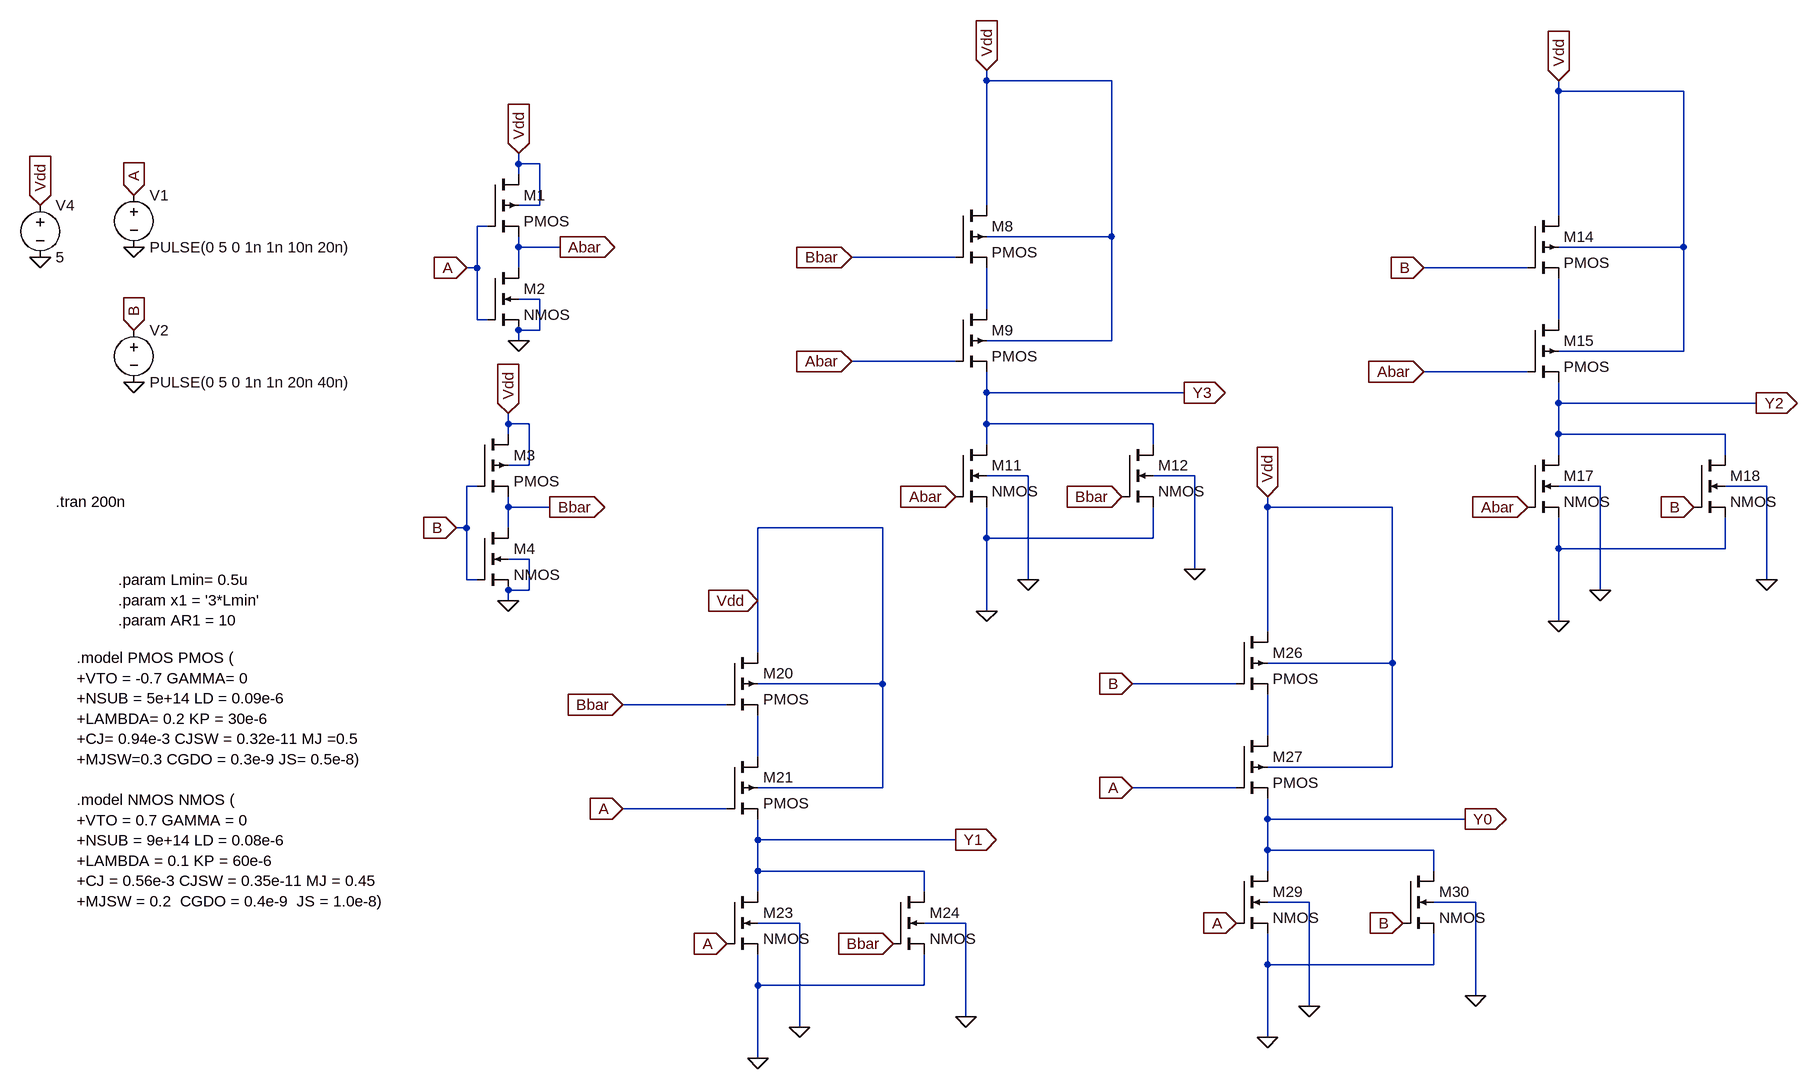
[diagram p0: schematic CMOS 2x4 decoder.asc]
CMOS 2x4 decoder.asc, the LTspice schematic file:
Version 4
SHEET 1 2264 3572
WIRE 976 -112 976 -128
WIRE 1168 -112 976 -112
WIRE 1856 -96 1856 -112
WIRE 2048 -96 1856 -96
WIRE 256 16 256 0
WIRE 288 16 256 16
WIRE 256 32 256 16
WIRE 288 80 288 16
WIRE 288 80 256 80
WIRE 976 80 976 -112
WIRE 1856 96 1856 -96
WIRE 208 112 192 112
WIRE 1168 128 1168 -112
WIRE 1168 128 976 128
WIRE 256 144 256 128
WIRE 320 144 256 144
WIRE 2048 144 2048 -96
WIRE 2048 144 1856 144
WIRE 928 160 768 160
WIRE 192 176 192 112
WIRE 192 176 176 176
WIRE 256 176 256 144
WIRE 1808 176 1648 176
WIRE 288 224 256 224
WIRE 976 240 976 176
WIRE 192 256 192 176
WIRE 208 256 192 256
WIRE 1856 256 1856 192
WIRE 288 272 288 224
WIRE 288 272 256 272
WIRE 256 288 256 272
WIRE 1168 288 1168 128
WIRE 1168 288 976 288
WIRE 2048 304 2048 144
WIRE 2048 304 1856 304
WIRE 928 320 768 320
WIRE 1808 336 1648 336
WIRE 976 368 976 336
WIRE 1280 368 976 368
WIRE 1856 384 1856 352
WIRE 2160 384 1856 384
WIRE 240 416 240 400
WIRE 272 416 240 416
WIRE 976 416 976 368
WIRE 1232 416 976 416
WIRE 240 432 240 416
WIRE 1856 432 1856 384
WIRE 2112 432 1856 432
WIRE 976 448 976 416
WIRE 1232 448 1232 416
WIRE 1856 464 1856 432
WIRE 2112 464 2112 432
WIRE 272 480 272 416
WIRE 272 480 240 480
WIRE 1040 496 976 496
WIRE 1296 496 1232 496
WIRE 192 512 176 512
WIRE 1920 512 1856 512
WIRE 2176 512 2112 512
WIRE 240 544 240 528
WIRE 304 544 240 544
WIRE 1408 544 1408 528
WIRE 1600 544 1408 544
WIRE 176 576 176 512
WIRE 176 576 160 576
WIRE 240 576 240 544
WIRE 816 576 624 576
WIRE 976 592 976 544
WIRE 1232 592 1232 544
WIRE 1232 592 976 592
WIRE 1856 608 1856 560
WIRE 2112 608 2112 560
WIRE 2112 608 1856 608
WIRE 272 624 240 624
WIRE 1296 640 1296 496
WIRE 176 656 176 576
WIRE 192 656 176 656
WIRE 1040 656 1040 496
WIRE 2176 656 2176 512
WIRE 272 672 272 624
WIRE 272 672 240 672
WIRE 1920 672 1920 512
WIRE 240 688 240 672
WIRE 624 688 624 576
WIRE 976 704 976 592
WIRE 1856 720 1856 608
WIRE 1408 736 1408 544
WIRE 624 768 624 688
WIRE 1600 784 1600 544
WIRE 1600 784 1408 784
WIRE 816 816 816 576
WIRE 816 816 624 816
WIRE 1360 816 1200 816
WIRE 576 848 416 848
WIRE 1408 896 1408 832
WIRE 624 928 624 864
WIRE 1600 944 1600 784
WIRE 1600 944 1408 944
WIRE 816 976 816 816
WIRE 816 976 624 976
WIRE 1360 976 1200 976
WIRE 576 1008 416 1008
WIRE 1408 1024 1408 992
WIRE 1712 1024 1408 1024
WIRE 624 1056 624 1024
WIRE 928 1056 624 1056
WIRE 1408 1072 1408 1024
WIRE 1664 1072 1408 1072
WIRE 624 1104 624 1056
WIRE 880 1104 624 1104
WIRE 1408 1104 1408 1072
WIRE 1664 1104 1664 1072
WIRE 624 1136 624 1104
WIRE 880 1136 880 1104
WIRE 1472 1152 1408 1152
WIRE 1728 1152 1664 1152
WIRE 688 1184 624 1184
WIRE 944 1184 880 1184
WIRE 1408 1248 1408 1200
WIRE 1664 1248 1664 1200
WIRE 1664 1248 1408 1248
WIRE 624 1280 624 1232
WIRE 880 1280 880 1232
WIRE 880 1280 624 1280
WIRE 1728 1296 1728 1152
WIRE 1472 1312 1472 1152
WIRE 944 1328 944 1184
WIRE 688 1344 688 1184
WIRE 1408 1360 1408 1248
WIRE 624 1392 624 1280
FLAG 256 288 0
FLAG 176 176 A
IOPIN 176 176 In
FLAG 320 144 Abar
IOPIN 320 144 Out
FLAG 256 0 Vdd
IOPIN 256 0 In
FLAG -336 272 B
IOPIN -336 272 In
FLAG -336 64 A
IOPIN -336 64 In
FLAG -336 144 0
FLAG -336 352 0
FLAG 240 688 0
FLAG 160 576 B
IOPIN 160 576 In
FLAG 304 544 Bbar
IOPIN 304 544 Out
FLAG 240 400 Vdd
IOPIN 240 400 In
FLAG 976 -128 Vdd
IOPIN 976 -128 In
FLAG 928 528 Abar
IOPIN 928 528 In
FLAG 1184 528 Bbar
IOPIN 1184 528 In
FLAG 1280 368 Y3
IOPIN 1280 368 Out
FLAG -480 80 Vdd
IOPIN -480 80 In
FLAG -480 160 0
FLAG 976 704 0
FLAG 1040 656 0
FLAG 1296 640 0
FLAG 768 160 Bbar
IOPIN 768 160 In
FLAG 768 320 Abar
IOPIN 768 320 In
FLAG 1856 -112 Vdd
IOPIN 1856 -112 In
FLAG 1808 544 Abar
IOPIN 1808 544 In
FLAG 2064 544 B
IOPIN 2064 544 In
FLAG 2160 384 Y2
IOPIN 2160 384 Out
FLAG 1856 720 0
FLAG 1920 672 0
FLAG 2176 656 0
FLAG 1648 176 B
IOPIN 1648 176 In
FLAG 1648 336 Abar
IOPIN 1648 336 In
FLAG 624 688 Vdd
IOPIN 624 688 In
FLAG 576 1216 A
IOPIN 576 1216 In
FLAG 832 1216 Bbar
IOPIN 832 1216 In
FLAG 928 1056 Y1
IOPIN 928 1056 Out
FLAG 624 1392 0
FLAG 688 1344 0
FLAG 944 1328 0
FLAG 416 848 Bbar
IOPIN 416 848 In
FLAG 416 1008 A
IOPIN 416 1008 In
FLAG 1408 528 Vdd
IOPIN 1408 528 In
FLAG 1360 1184 A
IOPIN 1360 1184 In
FLAG 1616 1184 B
IOPIN 1616 1184 In
FLAG 1712 1024 Y0
IOPIN 1712 1024 Out
FLAG 1408 1360 0
FLAG 1472 1312 0
FLAG 1728 1296 0
FLAG 1200 816 B
IOPIN 1200 816 In
FLAG 1200 976 A
IOPIN 1200 976 In
SYMBOL pmos4 208 32 R0
SYMATTR InstName M1
SYMATTR Value2 l={Lmin} w={AR1*Lmin} ad={x1*AR1*Lmin} as={x1*AR1*Lmin} pd={2*x1 + 2*AR1*Lmin} ps={2*x1 + 2*AR1*Lmin}
SYMBOL nmos4 208 176 R0
SYMATTR InstName M2
SYMATTR Value2 l={Lmin} w={AR1*Lmin} ad={x1*AR1*Lmin} as={x1*AR1*Lmin} pd={2*x1 + 2*AR1*Lmin} ps={2*x1 + 2*AR1*Lmin}
SYMBOL voltage -336 48 R0
WINDOW 123 0 0 Left 0
WINDOW 39 0 0 Left 0
SYMATTR InstName V1
SYMATTR Value PULSE(0 5 0 1n 1n 10n 20n)
SYMBOL voltage -336 256 R0
WINDOW 123 0 0 Left 0
WINDOW 39 0 0 Left 0
SYMATTR InstName V2
SYMATTR Value PULSE(0 5 0 1n 1n 20n 40n)
SYMBOL pmos4 192 432 R0
SYMATTR InstName M3
SYMATTR Value2 l={Lmin} w={AR1*Lmin} ad={x1*AR1*Lmin} as={x1*AR1*Lmin} pd={2*x1 + 2*AR1*Lmin} ps={2*x1 + 2*AR1*Lmin}
SYMBOL nmos4 192 576 R0
SYMATTR InstName M4
SYMATTR Value2 l={Lmin} w={AR1*Lmin} ad={x1*AR1*Lmin} as={x1*AR1*Lmin} pd={2*x1 + 2*AR1*Lmin} ps={2*x1 + 2*AR1*Lmin}
SYMBOL pmos4 928 80 R0
SYMATTR InstName M8
SYMATTR Value2 l={Lmin} w={AR1*Lmin} ad={x1*AR1*Lmin} as={x1*AR1*Lmin} pd={2*x1 + 2*AR1*Lmin} ps={2*x1 + 2*AR1*Lmin}
SYMBOL pmos4 928 240 R0
SYMATTR InstName M9
SYMATTR Value2 l={Lmin} w={AR1*Lmin} ad={x1*AR1*Lmin} as={x1*AR1*Lmin} pd={2*x1 + 2*AR1*Lmin} ps={2*x1 + 2*AR1*Lmin}
SYMBOL nmos4 928 448 R0
SYMATTR InstName M11
SYMATTR Value2 l={Lmin} w={AR1*Lmin} ad={x1*AR1*Lmin} as={x1*AR1*Lmin} pd={2*x1 + 2*AR1*Lmin} ps={2*x1 + 2*AR1*Lmin}
SYMBOL nmos4 1184 448 R0
SYMATTR InstName M12
SYMATTR Value2 l={Lmin} w={AR1*Lmin} ad={x1*AR1*Lmin} as={x1*AR1*Lmin} pd={2*x1 + 2*AR1*Lmin} ps={2*x1 + 2*AR1*Lmin}
SYMBOL voltage -480 64 R0
WINDOW 123 0 0 Left 0
WINDOW 39 0 0 Left 0
SYMATTR InstName V4
SYMATTR Value 5
SYMBOL pmos4 1808 96 R0
SYMATTR InstName M14
SYMATTR Value2 l={Lmin} w={AR1*Lmin} ad={x1*AR1*Lmin} as={x1*AR1*Lmin} pd={2*x1 + 2*AR1*Lmin} ps={2*x1 + 2*AR1*Lmin}
SYMBOL pmos4 1808 256 R0
SYMATTR InstName M15
SYMATTR Value2 l={Lmin} w={AR1*Lmin} ad={x1*AR1*Lmin} as={x1*AR1*Lmin} pd={2*x1 + 2*AR1*Lmin} ps={2*x1 + 2*AR1*Lmin}
SYMBOL nmos4 1808 464 R0
SYMATTR InstName M17
SYMATTR Value2 l={Lmin} w={AR1*Lmin} ad={x1*AR1*Lmin} as={x1*AR1*Lmin} pd={2*x1 + 2*AR1*Lmin} ps={2*x1 + 2*AR1*Lmin}
SYMBOL nmos4 2064 464 R0
SYMATTR InstName M18
SYMATTR Value2 l={Lmin} w={AR1*Lmin} ad={x1*AR1*Lmin} as={x1*AR1*Lmin} pd={2*x1 + 2*AR1*Lmin} ps={2*x1 + 2*AR1*Lmin}
SYMBOL pmos4 576 768 R0
SYMATTR InstName M20
SYMATTR Value2 l={Lmin} w={AR1*Lmin} ad={x1*AR1*Lmin} as={x1*AR1*Lmin} pd={2*x1 + 2*AR1*Lmin} ps={2*x1 + 2*AR1*Lmin}
SYMBOL pmos4 576 928 R0
SYMATTR InstName M21
SYMATTR Value2 l={Lmin} w={AR1*Lmin} ad={x1*AR1*Lmin} as={x1*AR1*Lmin} pd={2*x1 + 2*AR1*Lmin} ps={2*x1 + 2*AR1*Lmin}
SYMBOL nmos4 576 1136 R0
SYMATTR InstName M23
SYMATTR Value2 l={Lmin} w={AR1*Lmin} ad={x1*AR1*Lmin} as={x1*AR1*Lmin} pd={2*x1 + 2*AR1*Lmin} ps={2*x1 + 2*AR1*Lmin}
SYMBOL nmos4 832 1136 R0
SYMATTR InstName M24
SYMATTR Value2 l={Lmin} w={AR1*Lmin} ad={x1*AR1*Lmin} as={x1*AR1*Lmin} pd={2*x1 + 2*AR1*Lmin} ps={2*x1 + 2*AR1*Lmin}
SYMBOL pmos4 1360 736 R0
SYMATTR InstName M26
SYMATTR Value2 l={Lmin} w={AR1*Lmin} ad={x1*AR1*Lmin} as={x1*AR1*Lmin} pd={2*x1 + 2*AR1*Lmin} ps={2*x1 + 2*AR1*Lmin}
SYMBOL pmos4 1360 896 R0
SYMATTR InstName M27
SYMATTR Value2 l={Lmin} w={AR1*Lmin} ad={x1*AR1*Lmin} as={x1*AR1*Lmin} pd={2*x1 + 2*AR1*Lmin} ps={2*x1 + 2*AR1*Lmin}
SYMBOL nmos4 1360 1104 R0
SYMATTR InstName M29
SYMATTR Value2 l={Lmin} w={AR1*Lmin} ad={x1*AR1*Lmin} as={x1*AR1*Lmin} pd={2*x1 + 2*AR1*Lmin} ps={2*x1 + 2*AR1*Lmin}
SYMBOL nmos4 1616 1104 R0
SYMATTR InstName M30
SYMATTR Value2 l={Lmin} w={AR1*Lmin} ad={x1*AR1*Lmin} as={x1*AR1*Lmin} pd={2*x1 + 2*AR1*Lmin} ps={2*x1 + 2*AR1*Lmin}
TEXT -456 536 Left 2 !.tran 200n
TEXT -360 656 Left 2 !.param Lmin= 0.5u\n.param x1 = '3*Lmin'\n.param AR1 = 10
TEXT -424 776 Left 2 !.model PMOS PMOS (\n+VTO = -0.7 GAMMA= 0 \n+NSUB = 5e+14 LD = 0.09e-6 \n+LAMBDA= 0.2 KP = 30e-6\n+CJ= 0.94e-3 CJSW = 0.32e-11 MJ =0.5 \n+MJSW=0.3 CGDO = 0.3e-9 JS= 0.5e-8)\n \n.model NMOS NMOS ( \n+VTO = 0.7 GAMMA = 0 \n+NSUB = 9e+14 LD = 0.08e-6 \n+LAMBDA = 0.1 KP = 60e-6 \n+CJ = 0.56e-3 CJSW = 0.35e-11 MJ = 0.45 \n+MJSW = 0.2  CGDO = 0.4e-9  JS = 1.0e-8)

The netlist it stands for:
* CMOS 2x4 decoder.asc
M1 Vdd A Abar Vdd PMOS l={Lmin} w={AR1*Lmin} ad={x1*AR1*Lmin} as={x1*AR1*Lmin} pd={2*x1 + 2*AR1*Lmin} ps={2*x1 + 2*AR1*Lmin}
M2 Abar A 0 0 NMOS l={Lmin} w={AR1*Lmin} ad={x1*AR1*Lmin} as={x1*AR1*Lmin} pd={2*x1 + 2*AR1*Lmin} ps={2*x1 + 2*AR1*Lmin}
V1 A 0 PULSE(0 5 0 1n 1n 10n 20n)
V2 B 0 PULSE(0 5 0 1n 1n 20n 40n)
M3 Vdd B Bbar Vdd PMOS l={Lmin} w={AR1*Lmin} ad={x1*AR1*Lmin} as={x1*AR1*Lmin} pd={2*x1 + 2*AR1*Lmin} ps={2*x1 + 2*AR1*Lmin}
M4 Bbar B 0 0 NMOS l={Lmin} w={AR1*Lmin} ad={x1*AR1*Lmin} as={x1*AR1*Lmin} pd={2*x1 + 2*AR1*Lmin} ps={2*x1 + 2*AR1*Lmin}
M8 Vdd Bbar N001 Vdd PMOS l={Lmin} w={AR1*Lmin} ad={x1*AR1*Lmin} as={x1*AR1*Lmin} pd={2*x1 + 2*AR1*Lmin} ps={2*x1 + 2*AR1*Lmin}
M9 N001 Abar Y3 Vdd PMOS l={Lmin} w={AR1*Lmin} ad={x1*AR1*Lmin} as={x1*AR1*Lmin} pd={2*x1 + 2*AR1*Lmin} ps={2*x1 + 2*AR1*Lmin}
M11 Y3 Abar 0 0 NMOS l={Lmin} w={AR1*Lmin} ad={x1*AR1*Lmin} as={x1*AR1*Lmin} pd={2*x1 + 2*AR1*Lmin} ps={2*x1 + 2*AR1*Lmin}
M12 Y3 Bbar 0 0 NMOS l={Lmin} w={AR1*Lmin} ad={x1*AR1*Lmin} as={x1*AR1*Lmin} pd={2*x1 + 2*AR1*Lmin} ps={2*x1 + 2*AR1*Lmin}
V4 Vdd 0 5
M14 Vdd B N002 Vdd PMOS l={Lmin} w={AR1*Lmin} ad={x1*AR1*Lmin} as={x1*AR1*Lmin} pd={2*x1 + 2*AR1*Lmin} ps={2*x1 + 2*AR1*Lmin}
M15 N002 Abar Y2 Vdd PMOS l={Lmin} w={AR1*Lmin} ad={x1*AR1*Lmin} as={x1*AR1*Lmin} pd={2*x1 + 2*AR1*Lmin} ps={2*x1 + 2*AR1*Lmin}
M17 Y2 Abar 0 0 NMOS l={Lmin} w={AR1*Lmin} ad={x1*AR1*Lmin} as={x1*AR1*Lmin} pd={2*x1 + 2*AR1*Lmin} ps={2*x1 + 2*AR1*Lmin}
M18 Y2 B 0 0 NMOS l={Lmin} w={AR1*Lmin} ad={x1*AR1*Lmin} as={x1*AR1*Lmin} pd={2*x1 + 2*AR1*Lmin} ps={2*x1 + 2*AR1*Lmin}
M20 Vdd Bbar N004 Vdd PMOS l={Lmin} w={AR1*Lmin} ad={x1*AR1*Lmin} as={x1*AR1*Lmin} pd={2*x1 + 2*AR1*Lmin} ps={2*x1 + 2*AR1*Lmin}
M21 N004 A Y1 Vdd PMOS l={Lmin} w={AR1*Lmin} ad={x1*AR1*Lmin} as={x1*AR1*Lmin} pd={2*x1 + 2*AR1*Lmin} ps={2*x1 + 2*AR1*Lmin}
M23 Y1 A 0 0 NMOS l={Lmin} w={AR1*Lmin} ad={x1*AR1*Lmin} as={x1*AR1*Lmin} pd={2*x1 + 2*AR1*Lmin} ps={2*x1 + 2*AR1*Lmin}
M24 Y1 Bbar 0 0 NMOS l={Lmin} w={AR1*Lmin} ad={x1*AR1*Lmin} as={x1*AR1*Lmin} pd={2*x1 + 2*AR1*Lmin} ps={2*x1 + 2*AR1*Lmin}
M26 Vdd B N003 Vdd PMOS l={Lmin} w={AR1*Lmin} ad={x1*AR1*Lmin} as={x1*AR1*Lmin} pd={2*x1 + 2*AR1*Lmin} ps={2*x1 + 2*AR1*Lmin}
M27 N003 A Y0 Vdd PMOS l={Lmin} w={AR1*Lmin} ad={x1*AR1*Lmin} as={x1*AR1*Lmin} pd={2*x1 + 2*AR1*Lmin} ps={2*x1 + 2*AR1*Lmin}
M29 Y0 A 0 0 NMOS l={Lmin} w={AR1*Lmin} ad={x1*AR1*Lmin} as={x1*AR1*Lmin} pd={2*x1 + 2*AR1*Lmin} ps={2*x1 + 2*AR1*Lmin}
M30 Y0 B 0 0 NMOS l={Lmin} w={AR1*Lmin} ad={x1*AR1*Lmin} as={x1*AR1*Lmin} pd={2*x1 + 2*AR1*Lmin} ps={2*x1 + 2*AR1*Lmin}
.model NMOS NMOS
.model PMOS PMOS
.lib standard.mos
.tran 200n
.param Lmin= 0.5u
.param x1 = '3*Lmin'
.param AR1 = 10
.model PMOS PMOS (
+VTO = -0.7 GAMMA= 0
+NSUB = 5e+14 LD = 0.09e-6
+LAMBDA= 0.2 KP = 30e-6
+CJ= 0.94e-3 CJSW = 0.32e-11 MJ =0.5
+MJSW=0.3 CGDO = 0.3e-9 JS= 0.5e-8)
.model NMOS NMOS (
+VTO = 0.7 GAMMA = 0
+NSUB = 9e+14 LD = 0.08e-6
+LAMBDA = 0.1 KP = 60e-6
+CJ = 0.56e-3 CJSW = 0.35e-11 MJ = 0.45
+MJSW = 0.2  CGDO = 0.4e-9  JS = 1.0e-8)
.backanno
.end